# Altium schematic sheet DP_Slave_Sch.SchDoc
size A1
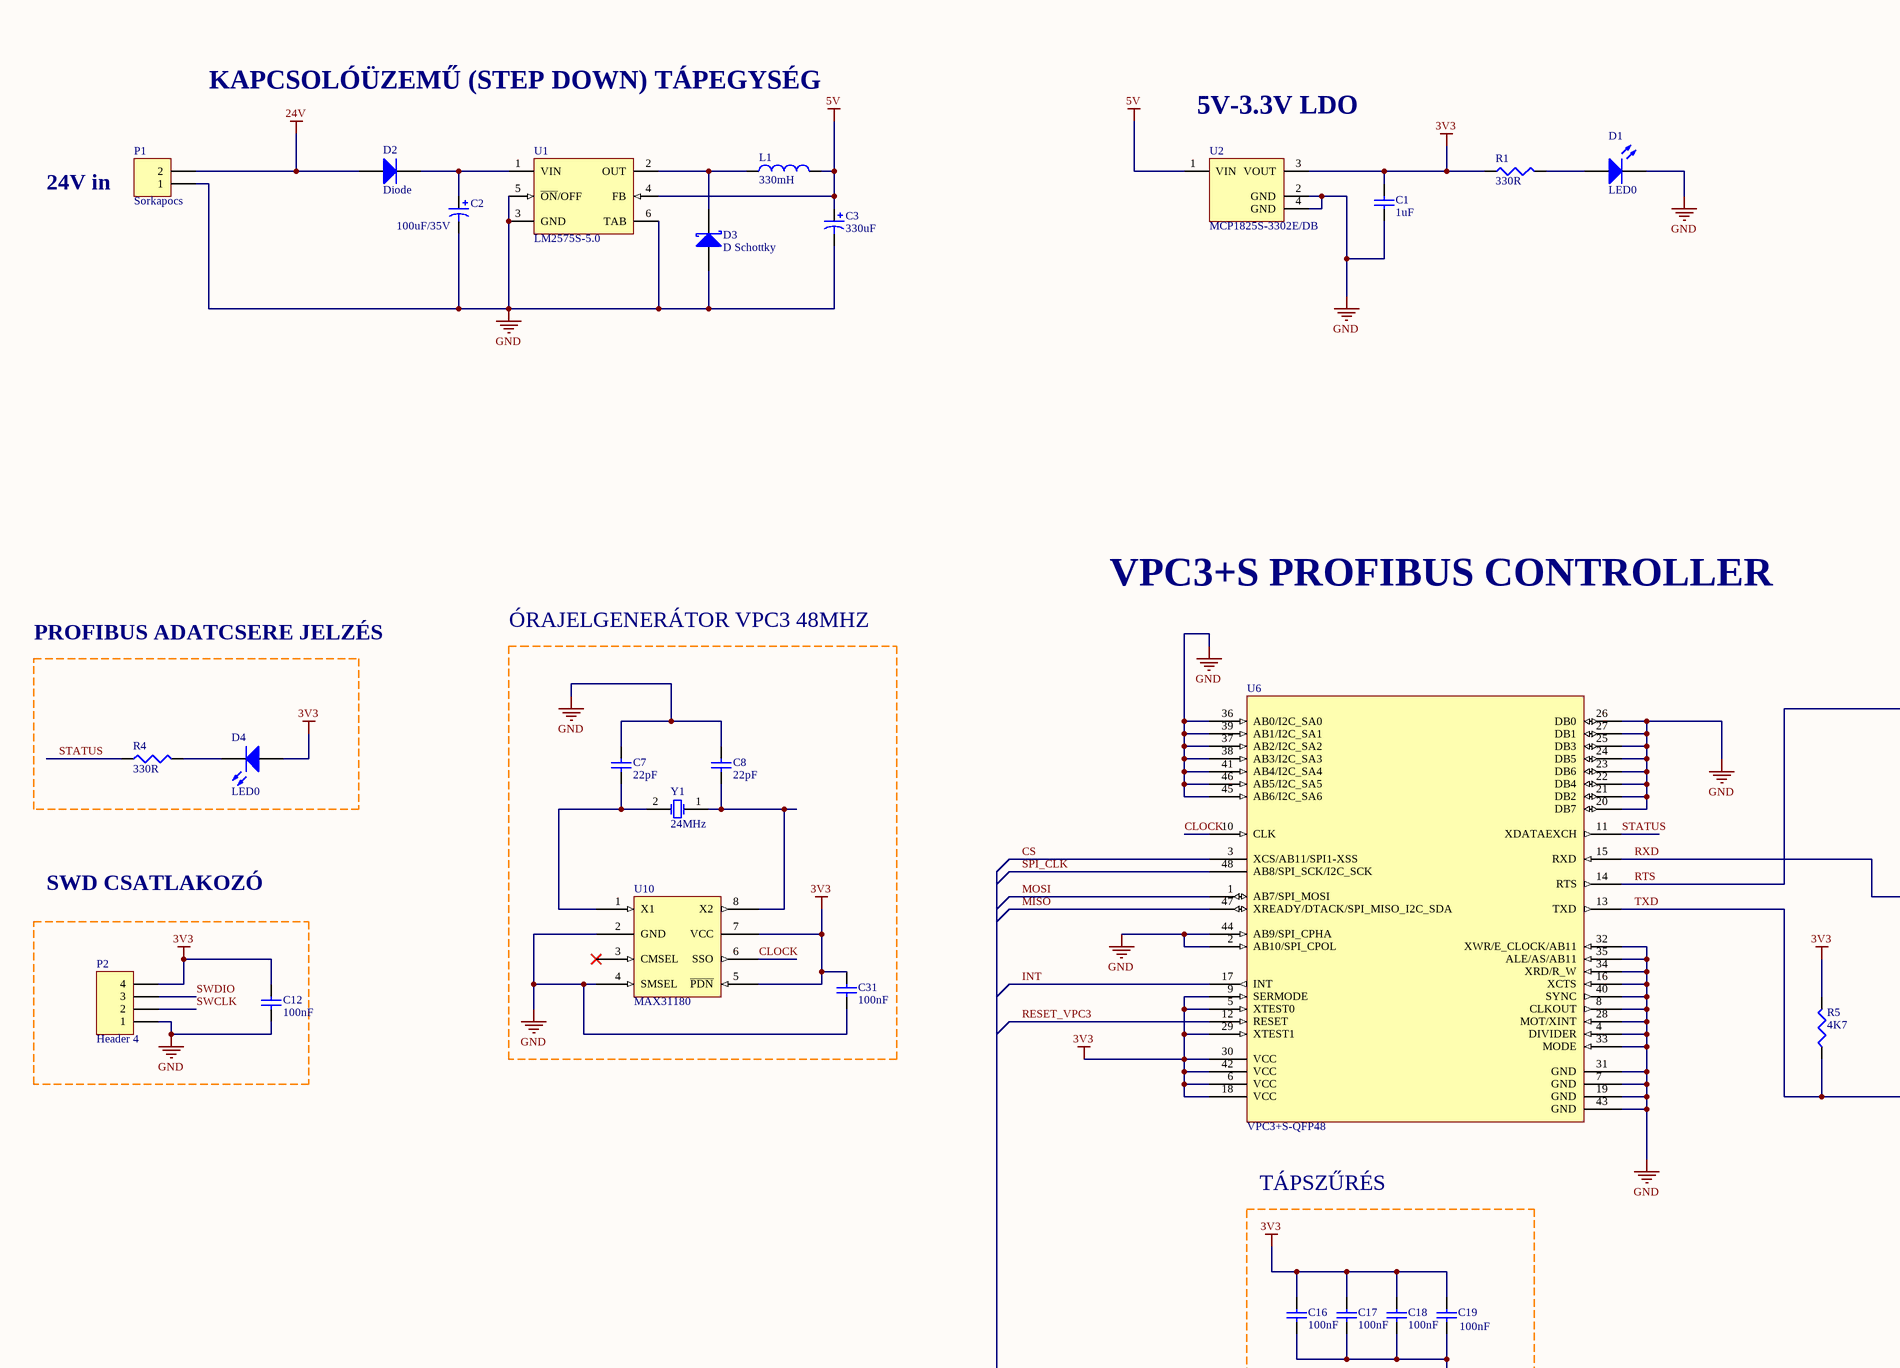
[diagram p0: DP_Slave_Sch.SchDoc, top left]
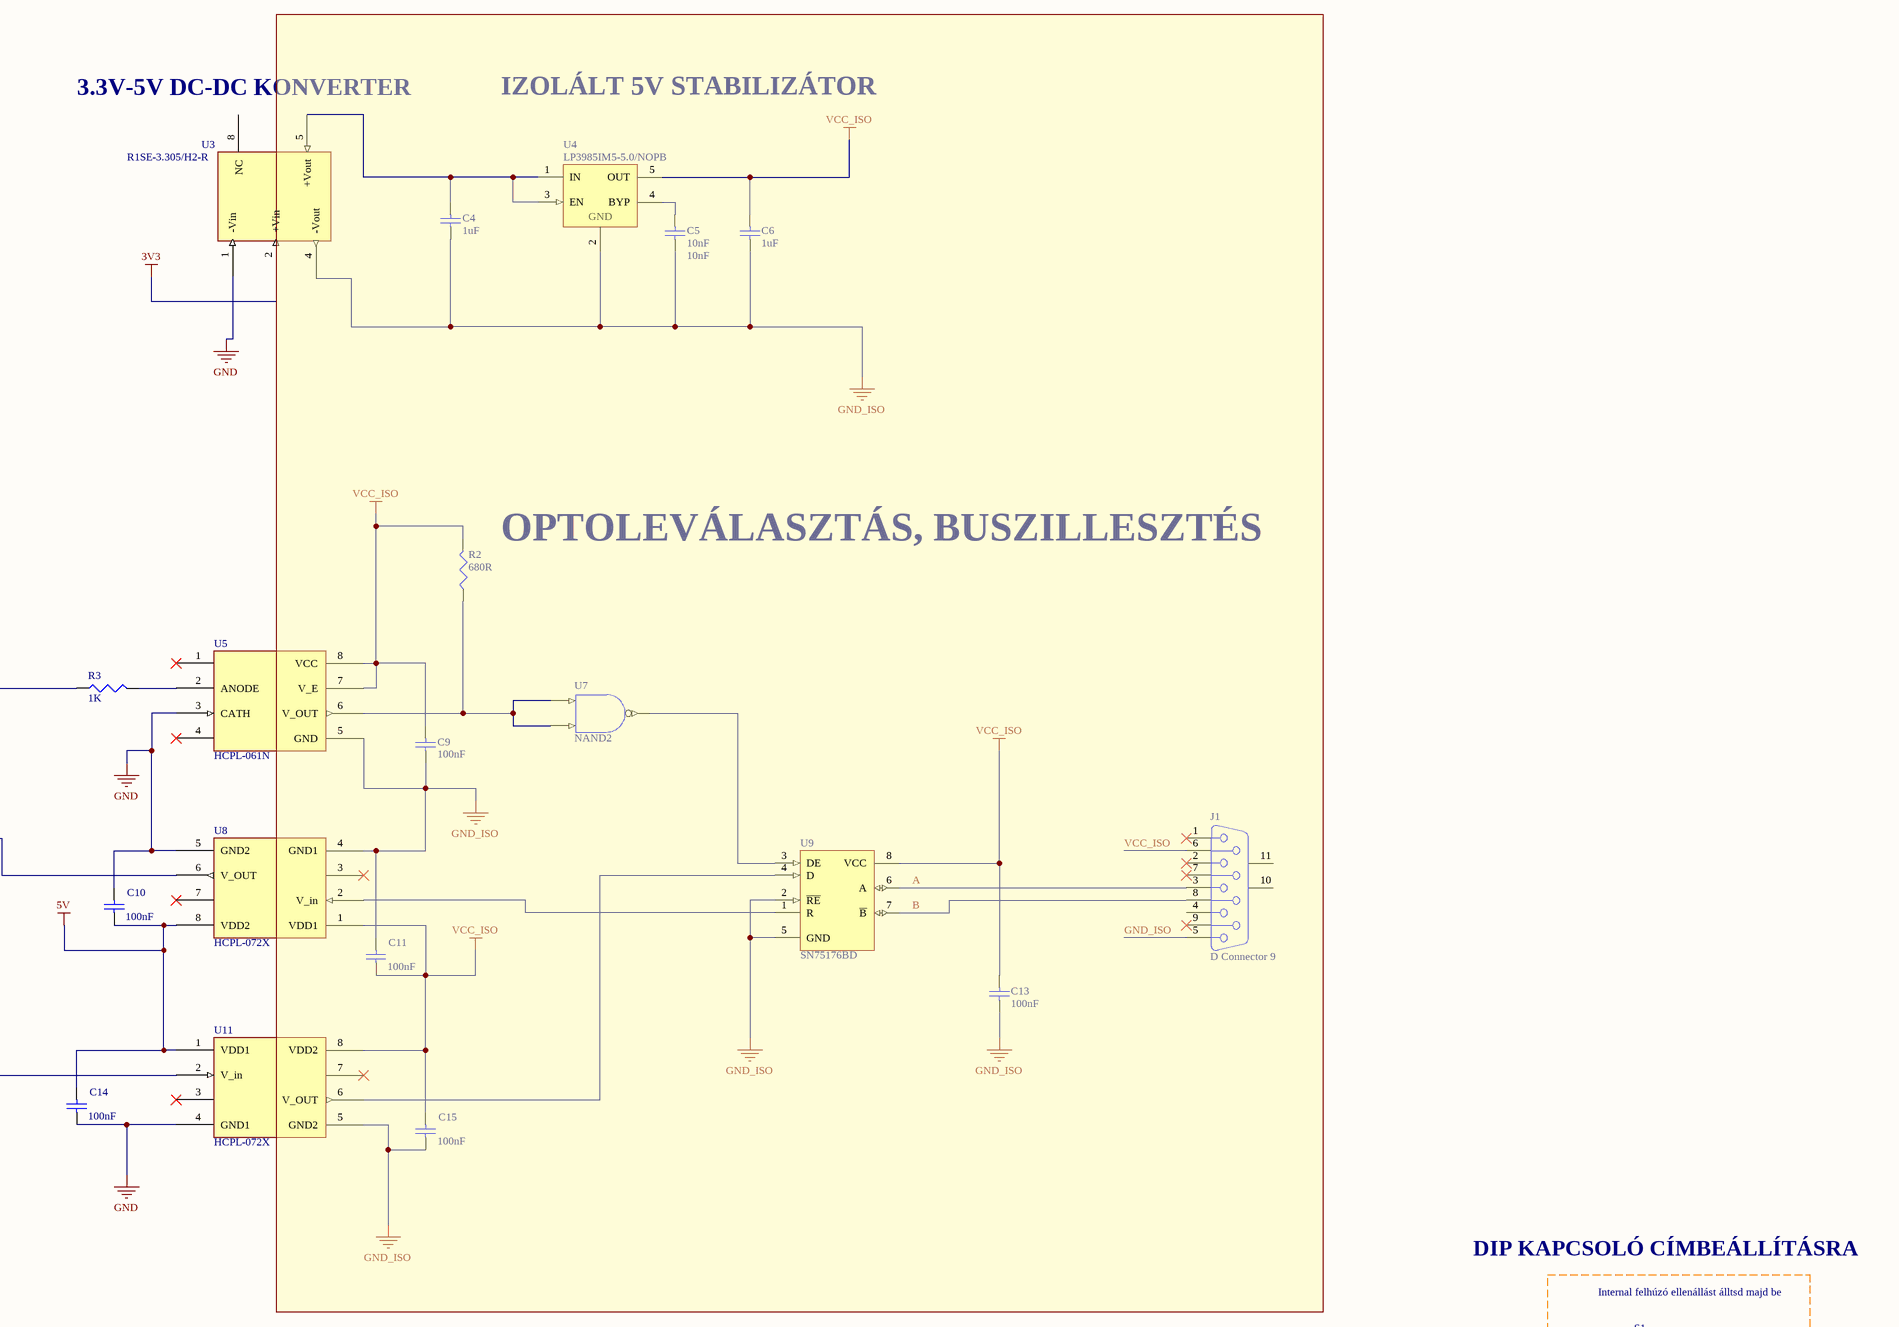
[diagram p1: DP_Slave_Sch.SchDoc, top right]
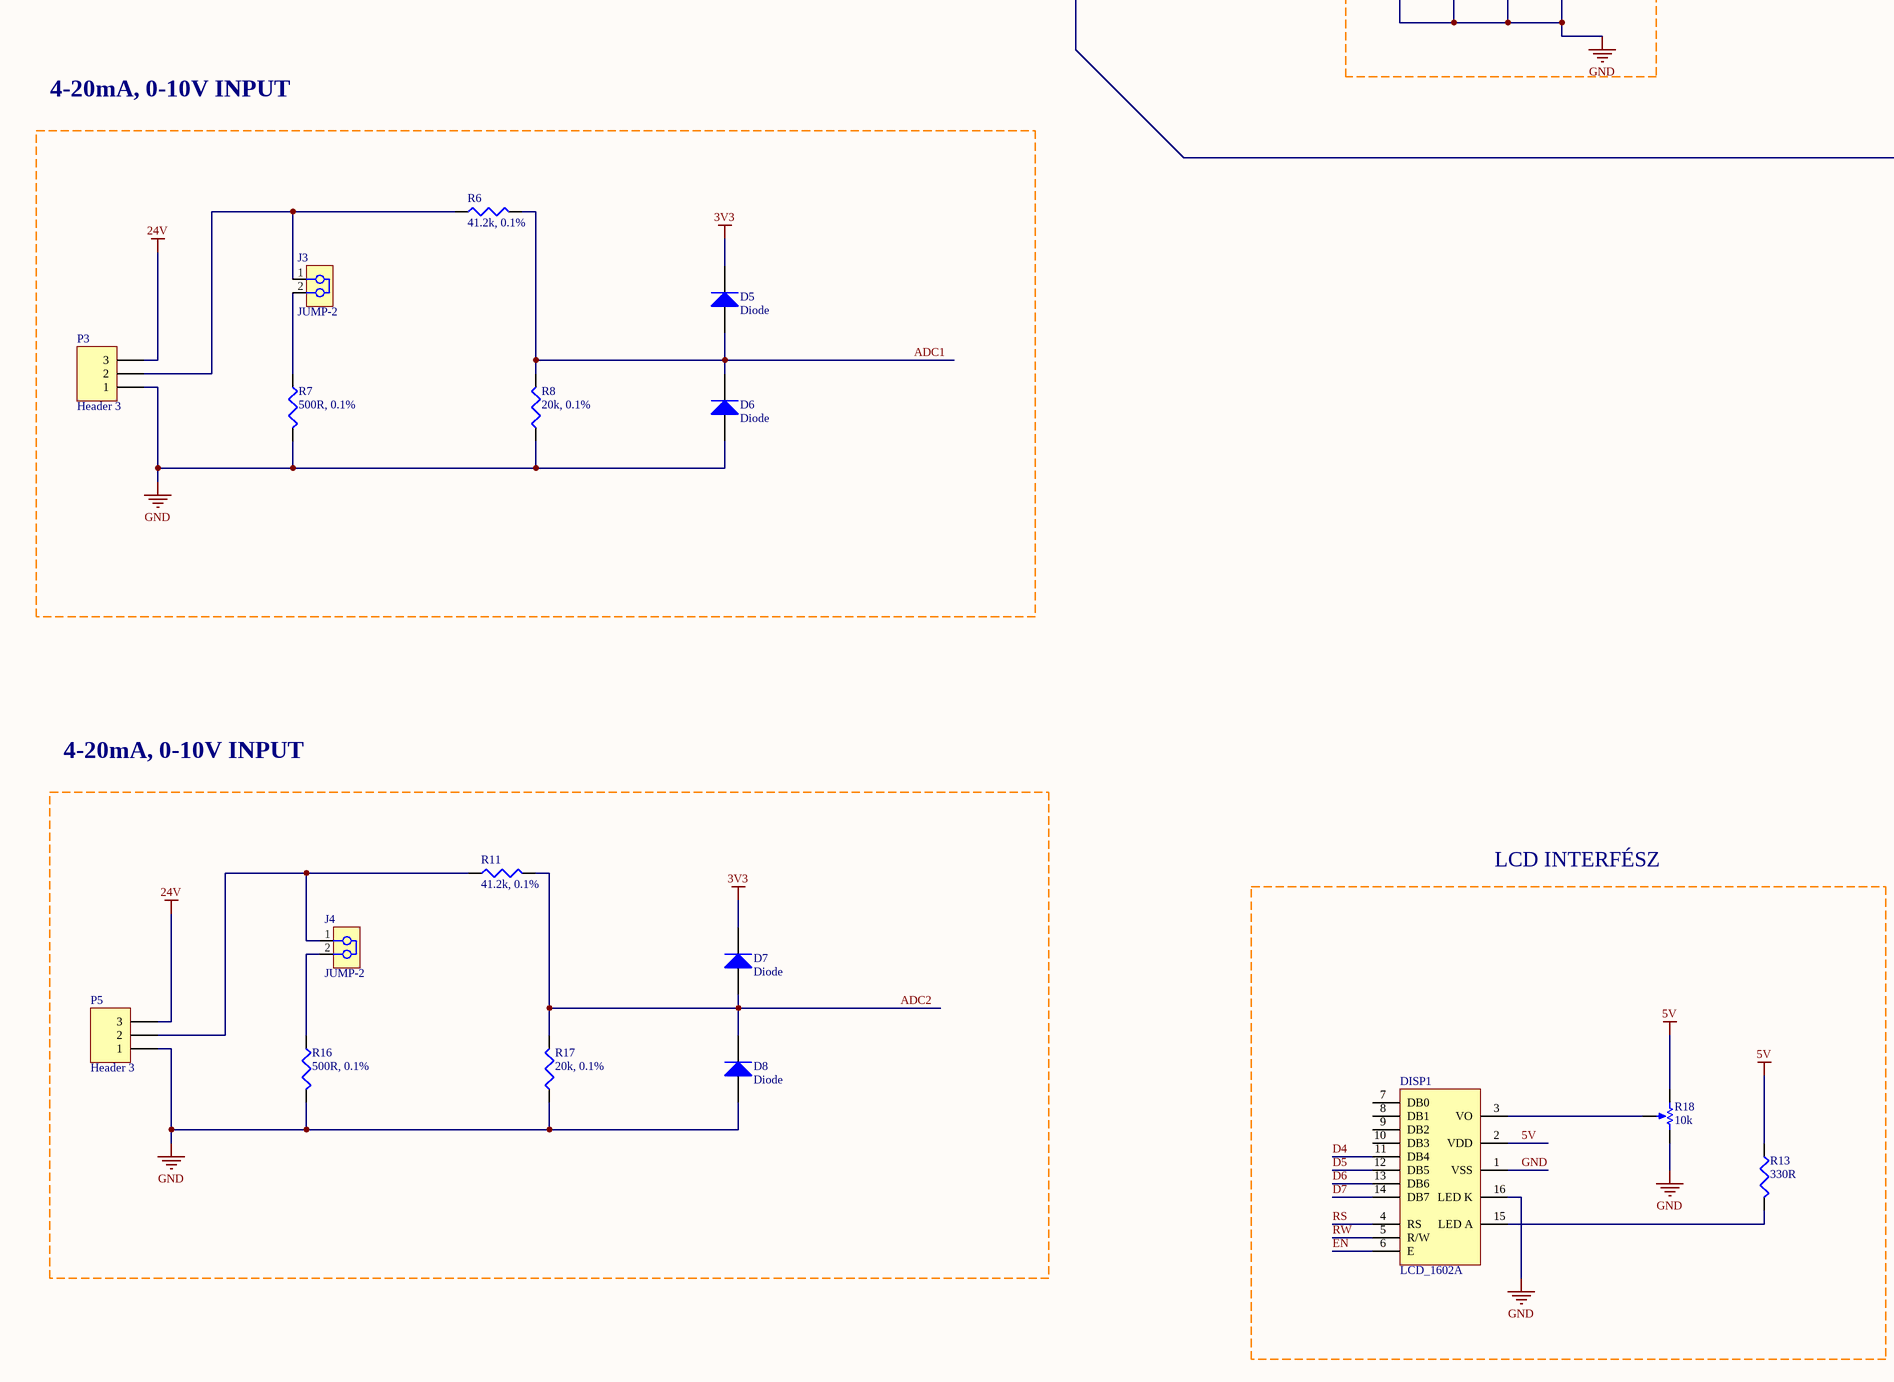
[diagram p2: DP_Slave_Sch.SchDoc, bottom left]
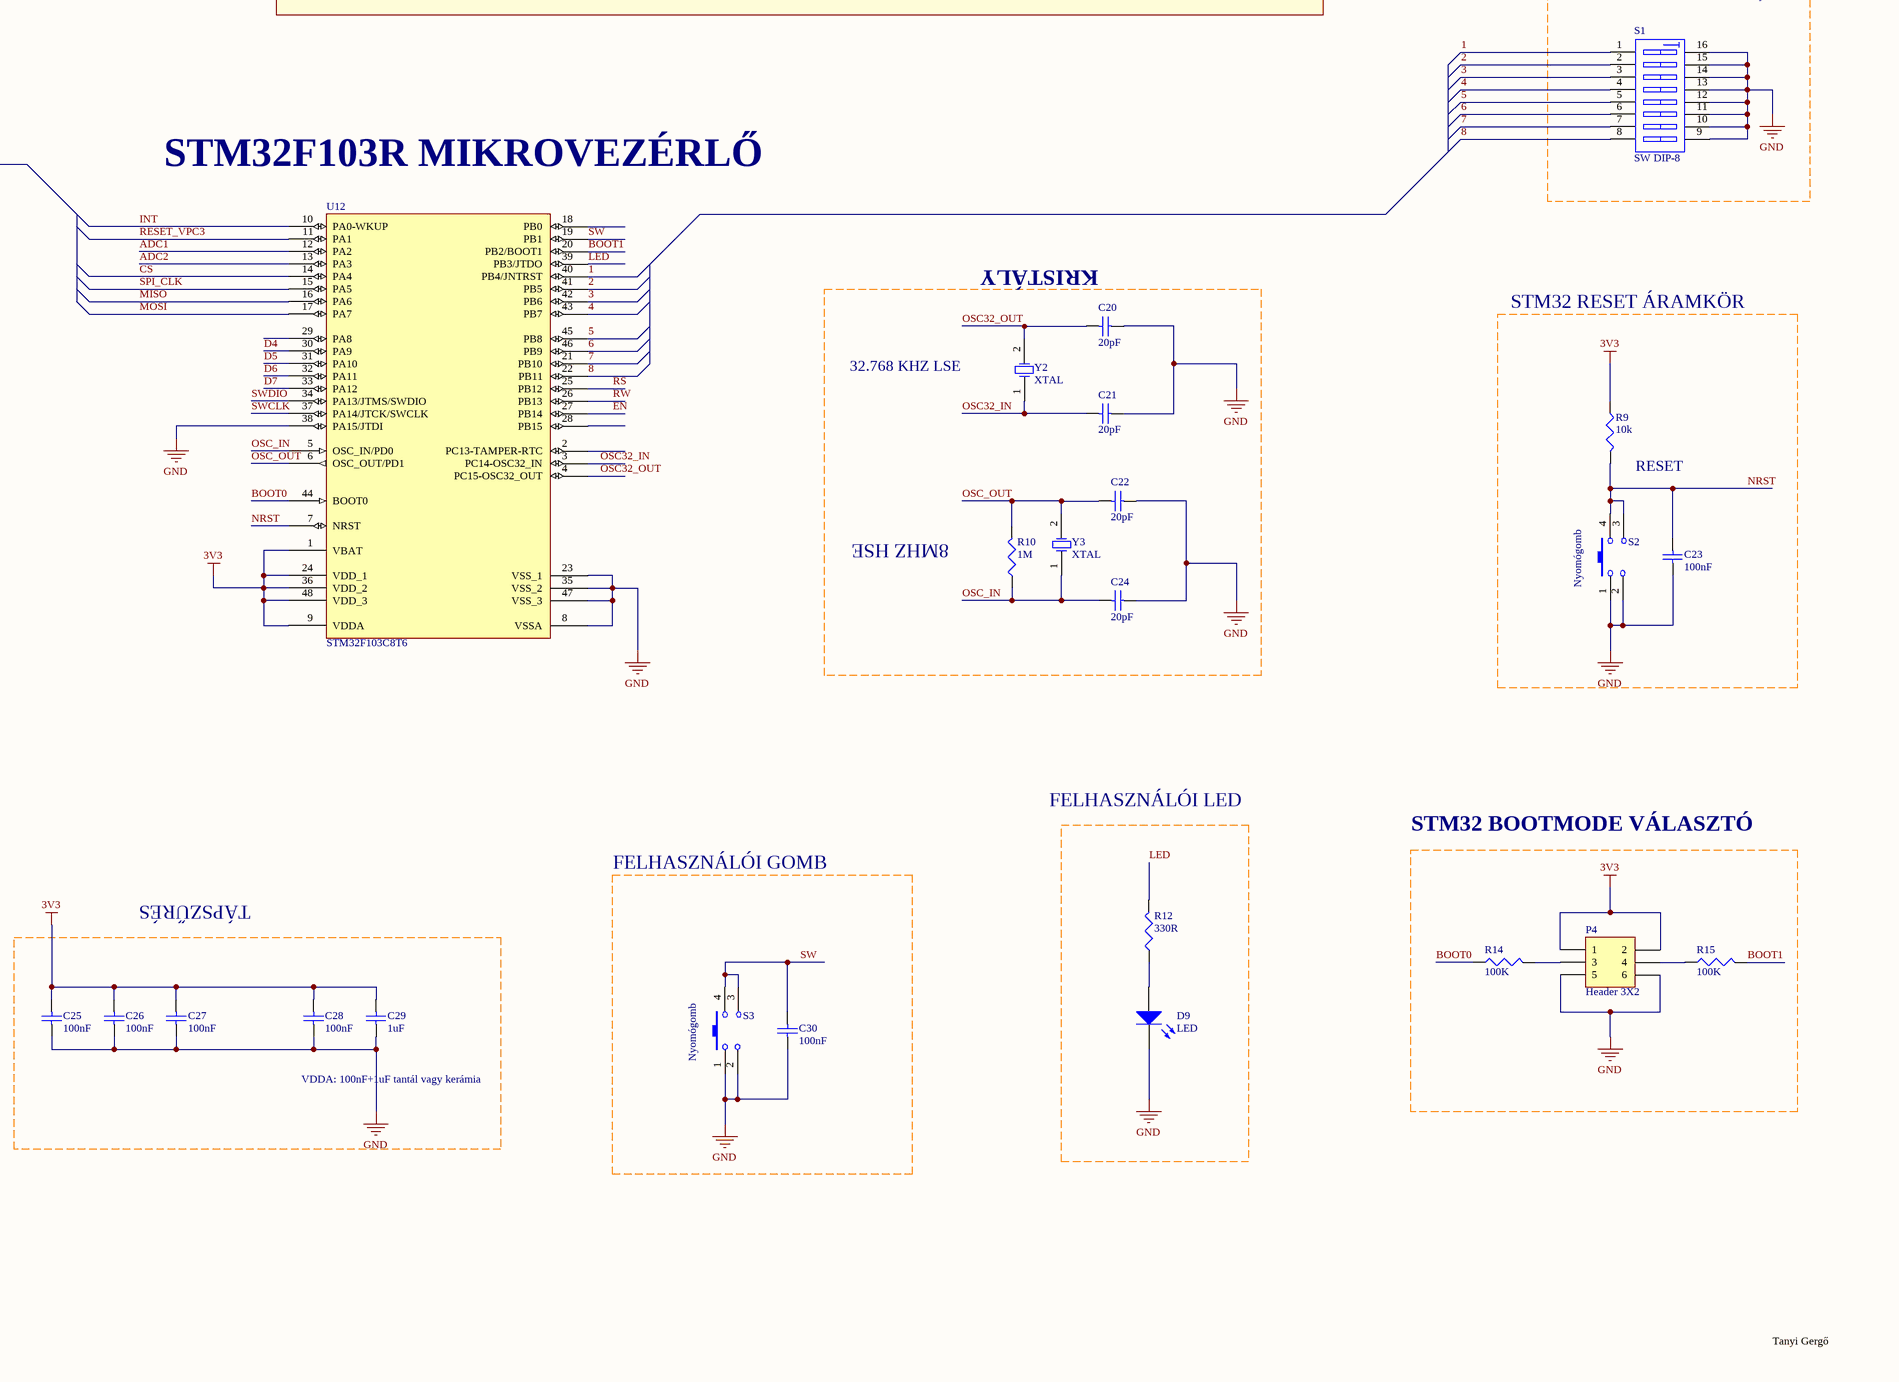
[diagram p3: DP_Slave_Sch.SchDoc, bottom right]

## Parts
C1  1uF  [C1206]
C2  100uF/35V  [SMD Elkó]
C3  330uF  [SMD Elkó]
C4  1uF  [C1206]
C5  10nF  [C1206]
C6  1uF  [C1206]
C7  22pF  [C1206]
C8  22pF  [C1206]
C9  100nF  [C1206]
C10  100nF  [C1206]
C11  100nF  [C1206]
C12  100nF  [C1206]
C13  100nF  [C1206]
C14  100nF  [C1206]
C15  100nF  [C1206]
C16  100nF  [C1206]
C17  100nF  [C1206]
C18  100nF  [C1206]
C19  100nF  [C1206]
C20  20pF  [C1206]
C21  20pF  [C1206]
C22  20pF  [C1206]
C23  100nF  [C1206]
C24  20pF  [C1206]
C25  100nF  [C1206]
C26  100nF  [C1206]
C27  100nF  [C1206]
C28  100nF  [C1206]
C29  1uF  [C1206]
C30  100nF  [C1206]
C31  100nF  [C1206]
D1  LED0  [C1206]
D2  Diode  [Dióda MiniMelf SOD80]
D3  D Schottky  [Schottky dióda]
D4  LED0  [C1206]
D5  Diode  [C1206]
D6  Diode  [C1206]
D7  Diode  [C1206]
D8  Diode  [C1206]
D9  LED  [c1206]
DISP1  LCD_1602A  [LCD]
J1  D Connector 9  [DSUB1.385-2H9]
J3  JUMP-2  [HDR1X2]
J4  JUMP-2  [HDR1X2]
L1  330mH  [SMD tekercs]
P1  Sorkapocs  [SORKAPOCS-2]
P2  Header 4  [HDR1X4]
P3  Header 3  [SORKAPOCS-3]
P4  Header 3X2  [HDR2X3]
P5  Header 3  [SORKAPOCS-3]
R1  330R  [C1206]
R2  680R  [C1206]
R3  1K  [C1206]
R4  330R  [C1206]
R5  4K7  [C1206]
R6  41.2k, 0.1%  [C1206]
R7  500R, 0.1%  [C1206]
R8  20k, 0.1%  [C1206]
R9  10k  [C1206]
R10  1M  [c1206]
R11  41.2k, 0.1%  [C1206]
R12  330R  [c1206]
R13  330R  [C1206]
R14  100K  [C1206]
R15  100K  [C1206]
R16  500R, 0.1%  [C1206]
R17  20k, 0.1%  [C1206]
R18  10k  [Potméter]
S1  SW DIP-8  [DIP switch]
S2  Nyomógomb  [Switch]
S3  Nyomógomb  [Switch]
U1  LM2575S-5.0  [TS5B_N]
U2  MCP1825S-3302E/DB  [SOT-223-DB3_N]
U3  R1SE-3.305/H2-R  [Isolated DC/DC converter]
U4  LP3985IM5-5.0/NOPB  [MF05A_N]
U5  HCPL-061N  [HCPL-061N]
U6  VPC3+S-QFP48  [TSQFP50P900X900X160-48N]
U7  NAND2  [NAND gate DIP14]
U8  HCPL-072X  [SOIC127P600X330-8N]
U9  SN75176BD  [D008_L]
U10  MAX31180  [MAX31180AUA+ -  Clock Generator]
U11  HCPL-072X  [SOIC127P600X330-8N]
U12  STM32F103C8T6  [LQFP48_N]
Y1  24MHz  [8 MHz SMD kristály]
Y2  XTAL  [32.768 MHz SMD kristály]
Y3  XTAL  [8 MHz SMD kristály]

## Blocks framed on the sheet
OPTOLEVÁLASZTÁS, BUSZILLESZTÉS: C4-C6 C9 C11 C13 C15 J1 R2 U4 U7 U9
PROFIBUS ADATCSERE JELZÉS: D4 R4
ÓRAJELGENERÁTOR VPC3 48MHZ: C7 C8 C31 U10 Y1
TÁPSZŰRÉS: C16-C19
Internal felhúzó ellenállást álltsd majd be: S1
8MHZ HSE: C20-C22 C24 R10 Y2 Y3
STM32 RESET ÁRAMKÖR: C23 R9 S2
LCD INTERFÉSZ: DISP1 R13 R18
STM32 BOOTMODE VÁLASZTÓ: P4 R14 R15
FELHASZNÁLÓI GOMB: C30 S3
VDDA: 100nF+1uF tantál vagy kerámia: C25-C29

## Nets
3V3: C1.2 C12.2 C16.2 C17.2 C18.2 C19.2 C25.2 C26.2 C27.2 C28.2 C29.2 C31.2 D4.1(A) D5.2(K) D7.2(K) P2.4 P4.1 P4.2 R1.1 R5.2 R9.1 U2.3(VOUT) U3.2(+Vin) U6.5(XTEST0) U6.6(VCC) U6.9(SERMODE) U6.18(VCC) U6.29(XTEST1) U6.30(VCC) U6.42(VCC) U10.5(~{PDN}) U10.7(VCC) U12.1(VBAT) U12.9(VDDA) U12.24(VDD_1) U12.36(VDD_2) U12.48(VDD_3)
5V: C3.1 C10.1 C14.2 DISP1.2(VDD) L1.2 R13.1 R18.1(TOP) U1.4(FB) U2.1(VIN) U8.8(VDD2) U11.1(VDD1)
24V: D2.1(A) P1.2 P3.3 P5.3
GND: C1.1 C2.2 C3.2 C7.2 C8.2 C10.2 C12.1 C14.1 C16.1 C17.1 C18.1 C19.1 C20.1 C21.1 C22.1 C23.1 C24.1 C25.1 C26.1 C27.1 C28.1 C29.1 C30.1 C31.1 D1.2(K) D3.1(A) D6.1(A) D8.1(A) D9.2(K) DISP1.1(VSS) DISP1.16(LED_K) P1.1 P2.1 P3.1 P4.5 P4.6 P5.1 R7.2 R8.1 R16.2 R17.1 R18.2(BOT) S1.9(B8) S1.10(B7) S1.11(B6) S1.12(B5) S1.13(B4) S1.14(B3) S1.15(B2) S1.16(B1) S2.1 S2.2 S3.1 S3.2 U1.3(GND) U1.5(~{ON}/OFF) U1.6(TAB) U2.2(GND) U2.4(GND) U3.1(-Vin) U5.3(CATH) U6.2(AB10/SPI_CPOL) U6.4(DIVIDER) U6.7(GND) U6.8(CLKOUT) U6.16(XCTS) U6.19(GND) U6.20(DB7) U6.21(DB2) U6.22(DB4) U6.23(DB6) U6.24(DB5) U6.25(DB3) U6.26(DB0) U6.27(DB1) U6.28(MOT/XINT) U6.31(GND) U6.32(XWR/E_CLOCK/AB11) U6.33(MODE) U6.34(XRD/R_W) U6.35(ALE/AS/AB11) U6.36(AB0/I2C_SA0) U6.37(AB2/I2C_SA2) U6.38(AB3/I2C_SA3) U6.39(AB1/I2C_SA1) U6.40(SYNC) U6.41(AB4/I2C_SA4) U6.43(GND) U6.44(AB9/SPI_CPHA) U6.45(AB6/I2C_SA6) U6.46(AB5/I2C_SA5) U8.5(GND2) U10.2(GND) U10.4(SMSEL) U11.4(GND1) U12.8(VSSA) U12.23(VSS_1) U12.35(VSS_2) U12.38(PA15/JTDI) U12.47(VSS_3)
GND_ISO: C4.1 C5.1 C6.1 C9.1 C11.2 C13.1 C15.1 J1.5 U3.4(-Vout) U4.2(GND) U5.5(GND) U8.4(GND1) U9.2(~{RE}) U9.5(GND) U11.5(GND2)
VCC_ISO: C6.2 C9.2 C11.1 C13.2 C15.2 J1.6 R2.2 U4.5(OUT) U5.7(V_E) U5.8(VCC) U8.1(VDD1) U9.8(VCC) U11.8(VDD2)
1: S1.1(A1) U12.40(PB4/JNTRST)
2: S1.2(A2) U12.41(PB5)
3: S1.3(A3) U12.42(PB6)
4: S1.4(A4) U12.43(PB7)
5: S1.5(A5) U12.45(PB8)
6: S1.6(A6) U12.46(PB9)
7: S1.7(A7) U12.21(PB10)
8: S1.8(A8) U12.22(PB11)
A: J1.3 U9.6(A)
ADC1: D5.1(A) D6.2(K) R6.2 R8.2 U12.12(PA2)
ADC2: D7.1(A) D8.2(K) R11.2 R17.2 U12.13(PA3)
B: J1.8 U9.7(~{B})
BOOT0: R14.1 U12.44(BOOT0)
BOOT1: R15.2 U12.20(PB2/BOOT1)
CLOCK: U6.10(CLK) U10.6(SSO)
CS: U6.3(XCS/AB11/SPI1-XSS) U12.14(PA4)
D4: DISP1.11(DB4) U12.30(PA9)
D5: DISP1.12(DB5) U12.31(PA10)
D6: DISP1.13(DB6) U12.32(PA11)
D7: DISP1.14(DB7) U12.33(PA12)
EN: DISP1.6(E) U12.27(PB14)
INT: U6.17(INT) U12.10(PA0-WKUP)
LED: R12.2 U12.39(PB3/JTDO)
MISO: U6.47(XREADY/DTACK/SPI_MISO_I2C_SDA) U12.16(PA6)
MOSI: U6.1(AB7/SPI_MOSI) U12.17(PA7)
NRST: C23.2 R9.2 S2.3 S2.4 U12.7(NRST)
OSC32_IN: C21.2 U12.3(PC14-OSC32_IN) Y2.1(OSC1)
OSC32_OUT: C20.2 U12.4(PC15-OSC32_OUT) Y2.2(OSC2)
OSC_IN: C24.2 R10.1 U12.5(OSC_IN/PD0) Y3.1(OSC1)
OSC_OUT: C22.2 R10.2 U12.6(OSC_OUT/PD1) Y3.2(OSC2)
RESET_VPC3: U6.12(RESET) U12.11(PA1)
RS: DISP1.4(RS) U12.25(PB12)
RTS: R3.1 U6.14(RTS)
RW: DISP1.5(R/W) U12.26(PB13)
RXD: U6.15(RXD) U8.6(V_OUT)
SPI_CLK: U6.48(AB8/SPI_SCK/I2C_SCK) U12.15(PA5)
STATUS: R4.1 U6.11(XDATAEXCH)
SW: C30.2 S3.3 S3.4 U12.19(PB1)
SWCLK: P2.2 U12.37(PA14/JTCK/SWCLK)
SWDIO: P2.3 U12.34(PA13/JTMS/SWDIO)
TXD: R5.1 U6.13(TXD) U11.2(V_in)
NetC2_1: C2.1 D2.2(K) U1.1(VIN)
NetC4_2: C4.2 U3.5(+Vout) U4.1(IN) U4.3(EN)
NetC5_2: C5.2 U4.4(BYP)
NetC7_1: C7.1 U10.1(X1) Y1.2(OSC2)
NetC8_1: C8.1 U10.8(X2) Y1.1(OSC1)
NetD1_1: D1.1(A) R1.2
NetD3_2: D3.2(K) L1.1 U1.2(OUT)
NetD4_2: D4.2(K) R4.2
NetD9_1: D9.1(A) R12.1
NetDISP1_3: DISP1.3(VO) R18.3(TAP)
NetDISP1_15: DISP1.15(LED_A) R13.2
NetJ3_1: J3.1(C1) P3.2 R6.1
NetJ3_2: J3.2(C2) R7.1
NetJ4_1: J4.1(C1) P5.2 R11.1
NetJ4_2: J4.2(C2) R16.1
NetP4_3: P4.3 R14.2
NetP4_4: P4.4 R15.1
NetR2_1: R2.1 U5.6(V_OUT) U7.1(A) U7.2(B)
NetR3_2: R3.2 U5.2(ANODE)
NetU7_3: U7.3(Y) U9.3(DE)
NetU8_2: U8.2(V_in) U9.1(R)
NetU9_4: U9.4(D) U11.6(V_OUT)

Not connected (* = marked no-connect by the designer): DISP1 7(DB0) 8(DB1) 9(DB2) 10(DB3); J1 1* 2* 4 7* 9* 10(MH1) 11(MH2); U3 8(NC); U5 1* 4*; U8 3* 7*; U10 3(CMSEL)*; U11 3* 7*; U12 2(PC13-TAMPER-RTC) 18(PB0) 28(PB15) 29(PA8)

## Notes on the sheet
- KAPCSOLÓÜZEMŰ (STEP DOWN) TÁPEGYSÉG
- 5V-3.3V LDO
- 3.3V-5V DC-DC KONVERTER
- IZOLÁLT 5V STABILIZÁTOR
- 24V in
- VPC3+S PROFIBUS CONTROLLER
- SWD CSATLAKOZÓ
- DIP KAPCSOLÓ CÍMBEÁLLÍTÁSRA
- 4-20mA, 0-10V INPUT
- STM32F103R MIKROVEZÉRLŐ
- (near C20) KRISTÁLY
- 32.768 KHZ LSE
- (near R9) RESET
- FELHASZNÁLÓI LED
- TÁPSZŰRÉS
- Tanyi Gergő

## Library data of the parts
C1 C12 C23 = Cap Semi: Szűrőkondi; Published: 8-Jun-2000; LatestRevisionDate: 29-May-2009; LatestRevisionNote: IPC-7351 Footprint Added.; PackageReference: C1206; Publisher: Altium Limited; PackageDescription: Chip Capacitor
  C1: Value: 1uF; ComponentLink1Description: Farnell; ComponentLink1URL: http://hu.farnell.com/multicomp/mcsh31b105k100ct/cap-mlcc-x7r-1uf-10v-1206/dp/1856632
  C12 C23: Value: 100nF
C2 = Cap Pol3: SMD elkó/40V; Value: 10uF; Published: 8-Jun-2000; LatestRevisionDate: 29-May-2009; LatestRevisionNote: IPC-7351 Footprint Added.; PackageReference: C0805; Publisher: Altium Limited; PackageDescription: Chip Capacitor; ComponentLink1Description: Farnell; ComponentLink1URL: http://hu.farnell.com/panasonic-electronic-components/eeehd1c100ar/cap-alu-elec-10uf-16v-smd/dp/1714728
C3 = Cap Pol3: LDO kimeneti polárkondi; Value: 10uF; Published: 8-Jun-2000; LatestRevisionDate: 29-May-2009; LatestRevisionNote: IPC-7351 Footprint Added.; PackageReference: C0805; Publisher: Altium Limited; PackageDescription: Chip Capacitor; ComponentLink1Description: Farnell; ComponentLink1URL: http://hu.farnell.com/panasonic-electronic-components/eeehd1c100ar/cap-alu-elec-10uf-16v-smd/dp/1714728
C4-C6 C16-C19 C31 = Cap Semi: Capacitor (Semiconductor SIM Model); Published: 8-Jun-2000; LatestRevisionDate: 29-May-2009; LatestRevisionNote: IPC-7351 Footprint Added.; PackageReference: C1206; Publisher: Altium Limited; PackageDescription: Chip Capacitor
  C4 C6: Value: 1uF
  C5: Value: 10nF
  C16-C19 C31: Value: 100nF
C7 C8 = Cap Semi: SMD kerámia; Value: 18pF; Published: 8-Jun-2000; LatestRevisionDate: 29-May-2009; LatestRevisionNote: IPC-7351 Footprint Added.; PackageReference: C1206; Publisher: Altium Limited; PackageDescription: Chip Capacitor
C9-C11 C13-C15 = Cap Semi: SMD KERÁMIA; Published: 8-Jun-2000; LatestRevisionDate: 29-May-2009; LatestRevisionNote: IPC-7351 Footprint Added.; PackageReference: C1206; Publisher: Altium Limited; PackageDescription: Chip Capacitor; Value: 100nF
C20-C22 C24 = Cap Semi: SMD kerámia; Value: 100pF; Published: 8-Jun-2000; LatestRevisionDate: 29-May-2009; LatestRevisionNote: IPC-7351 Footprint Added.; PackageReference: C1206; Publisher: Altium Limited; PackageDescription: Chip Capacitor
C25-C30 = Cap Semi: SMD kerámia; Published: 8-Jun-2000; LatestRevisionDate: 29-May-2009; LatestRevisionNote: IPC-7351 Footprint Added.; PackageReference: C1206; Publisher: Altium Limited; PackageDescription: Chip Capacitor
  C25-C28: Value: 100nF; ComponentLink1Description: Farnell; ComponentLink1URL: http://hu.farnell.com/avx/12063c104mat2a/ceramic-capacitor-0-1uf-25v-x7r/dp/4538754
  C29: Value: 1uF; ComponentLink1Description: Farnell; ComponentLink1URL: http://hu.farnell.com/avx/12063c104mat2a/ceramic-capacitor-0-1uf-25v-x7r/dp/4538754
  C30: Value: 100nF
D1 D4 = LED0: Typical INFRARED GaAs LED; Published: 8-Jun-2000; LatestRevisionDate: 08-Jul-2005; LatestRevisionNote: Mech Layer 1 removed.; PackageReference: LED-0; Publisher: Altium Limited; PackageDescription: LED; 2 Leads
D3 = D Schottky: Schottky Diode; Published: 8-Jun-2000; LatestRevisionDate: 17-Jul-2002; LatestRevisionNote: Re-released for DXP Platform.; PackageReference: SMB; Publisher: Altium Limited; PackageDescription: DO-214-AA/SMB; 2 C-Bend Leads; Body 5.3 x 3.6 mm, inc. leads (LxW); Code_JEDEC: DO-214-AA
D5-D8 = Diode: Default Diode; Published: 8-Jun-2000; LatestRevisionDate: 17-Jul-2002; LatestRevisionNote: Re-released for DXP Platform.; PackageVersion: Sep-1996; PackageReference: SMC; Publisher: Altium Limited; PackageDescription: DO-214-AB/SMC; 2 C-Bend Leads; Body 7.9 x 5.9 mm, inc. leads (LxW); Code_JEDEC: DO-214-AB
D9 = LED2: Piros felhasználói LED; Published: 8-Jun-2000; LatestRevisionDate: 17-Jul-2002; LatestRevisionNote: Re-released for DXP Platform.; PackageVersion: Feb-2002; PackageReference: 3.2X1.6X1.1; Publisher: Altium Limited; PackageDescription: SM LED; 2 Flat Leads
J1 = D Connector 9: Receptacle Assembly, 9 Position, Right Angle; PackageDocument: O; Positions: 9; Published: 15-Jun-2001; LatestRevisionDate: 17-Jul-2002; LatestRevisionNote: Re-released for DXP Platform.; DatasheetDocument: 1-Sep-1999; PackageReference: 788750; Publisher: Altium Limited; Orientation: Right Angle; Gender: Receptacle
L1 = Inductor: Code_IEC: 1005; Value: 10mH; Published: 8-Jun-2000; LatestRevisionDate: 29-May-2009; LatestRevisionNote: IPC-7351 Footprint Added.; PackageReference: 0402-A; Publisher: Altium Limited; PackageDescription: Chip Inductor; Code_JEITA: 0402
P1 = Header 2: 12V input; LatestRevisionDate: 17-Jul-2002; LatestRevisionNote: Re-released for DXP Platform.; Publisher: Altium Limited; ComponentLink1Description: Farnell; ComponentLink1URL: http://hu.farnell.com/switchcraft/rasm712x/jack-socket-dc/dp/1608734
P2 = Header 4: Header, 4-Pin; LatestRevisionDate: 17-Jul-2002; LatestRevisionNote: Re-released for DXP Platform.; Publisher: Altium Limited
P3 P5 = Header 3: Header, 3-Pin; LatestRevisionDate: 17-Jul-2002; LatestRevisionNote: Re-released for DXP Platform.; Publisher: Altium Limited
P4 = Header 3X2: Header, 3-Pin, Dual row; LatestRevisionDate: 17-Jul-2002; LatestRevisionNote: Re-released for DXP Platform.; Publisher: Altium Limited
R1 R4 R5 R10 R12 R14 R15 = Res3: SMD ellenállás; Value: 220; Published: 8-Jun-2000; LatestRevisionDate: 29-May-2009; LatestRevisionNote: IPC-7351 Footprint Added.; PackageReference: J1-0603; Publisher: Altium Limited; PackageDescription: Chip Resistor
R2 = Res3: Resistor; Published: 8-Jun-2000; LatestRevisionDate: 29-May-2009; LatestRevisionNote: IPC-7351 Footprint Added.; PackageReference: J1-0603; Publisher: Altium Limited; PackageDescription: Chip Resistor; Value: 680R
R3 = Res3: SMD ELLENÁLLÁS; Published: 8-Jun-2000; LatestRevisionDate: 29-May-2009; LatestRevisionNote: IPC-7351 Footprint Added.; PackageReference: J1-0603; Publisher: Altium Limited; PackageDescription: Chip Resistor; Value: 1K
R6-R9 R11 R13 R16 R17 = Res3: SMD ellenállás; Value: 330; Published: 8-Jun-2000; LatestRevisionDate: 29-May-2009; LatestRevisionNote: IPC-7351 Footprint Added.; PackageReference: J1-0603; Publisher: Altium Limited; PackageDescription: Chip Resistor
R18 = RPot: Potentiometer; Sim Note: Enter the Resistance value and the set point into parameter fields.; Set Position: 0.5; Value: 1K; Published: 8-Jun-2000; LatestRevisionDate: 17-Jul-2002; LatestRevisionNote: Re-released for DXP Platform.; PackageReference: VR5; Publisher: Altium Limited; PackageDescription: Variable Resistor, Thru-Hole; 3 Leads
S1 = SW DIP-8: DIP Switch, 8 Position, SPST; Published: 24-Mar-1999; LatestRevisionDate: 17-Jul-2002; LatestRevisionNote: Re-released for DXP Platform.; PackageReference: DIP_SW_8WAY_SMD; Publisher: Altium Limited; PackageDescription: DIP Switch; 16 Leads
S2 S3 = Tactile switch: 4 lábas, SMD, tactile; Mfr1: ALCOSWITCH - TE CONNECTIVITY; Mfr1 PN: FSM2JSMLS; ComponentLink1Description: Farnell; ComponentLink1URL: http://hu.farnell.com/te-connectivity-alcoswitch/fsm2jsmls/tactile-switch-spst-no-0-05a-24v/dp/2610948#anchorTechnicalDOCS; ComponentLink2Description: Datasheet; ComponentLink2URL: http://www.farnell.com/datasheets/2074943.pdf?_ga=2.199799912.731263013.1500916928-158472119.1495987916
U1 = LM2575S-5.0: SIMPLE SWITCHER® 1A Step-Down Voltage Regulator, 5-pin TO-263; Manufacturer: National Semiconductor; PackageTopMarking: NSUZXYTTE#*LM2575S*-5.0 P+; PowerWise: N; Published: 4-Dec-2008; DatasheetVersion: Apr-2007; PackageVersion: revD, Apr-2005; PackageReference: TS5B; Publisher: Altium Limited; PackageDescription: TO-263, Molded, .400 x .390 x .180in, 5 Lead, .067in Pitch, Surface Mount; Supplier 1: Farnell; Supplier Part Number 1: 1523849; Supplier 2: Farnell; Supplier Part Number 2: 9489860; PartNumber: LM2575S-5.0; RoHS: N; PinCount: 5; CompType: Switcher; Code_JEDEC: MO-169-AB; ComponentLink1Description: LM2575 Datasheet; ComponentLink1URL: http://www.national.com/ds/LM/LM2575.pdf; ComponentLink2Description: LM2575 Web Page; ComponentLink2URL: http://www.national.com/pf/LM/LM2575.html; ComponentLink3Description: TS5B Package Page; ComponentLink3URL: http://www.national.com/packaging/folders/ts5b.html
U2 = MCP1825S-3302E/DB: 500 mA, Low Voltage, Low Quiescent Current LDO Regulator, 3-Pin SOT-223, Extended Temperature; Manufacturer: Microchip; DatasheetVersion: revB, Feb-2008; PackageVersion: revBB, Aug-2009; PackageReference: SOT-223-DB3; PackageDescription: 3-Lead Plastic Small Outline Transistor (DB) [SOT-223]; Supplier 1: Digi-Key; Supplier Part Number 1: MCP1825S-3302E/DB-ND; Supplier 2: Farnell; Supplier Part Number 2: 1578404; Supplier 3: Newark; Supplier Part Number 3: 26M9961; Supplier 4: Mouser; Supplier Part Number 4: 579-MCP1825S-3302EDB; Mounting Technology: Surface Mount; PartNumber: MCP1825S-3302E/DB; ComponentLink1Description: Farnell; ComponentLink1URL: http://hu.farnell.com/microchip/mcp1825s-3302e-db/ic-ldo-3-3v-500ma-sot-223-3/dp/1578404?ost=MCP1825S-3302E%2FDB&scope=partnumberlookahead&exaMfpn=true&searchref=searchlookahead&searchView=table&iscrfnonsku=false&ddkey=http%3Ahu-HU%2FElement14_Hungary%2Fw%2Fsearch; ComponentLink2Description: Datasheet; ComponentLink2URL: http://ww1.microchip.com/downloads/en/DeviceDoc/22056b.pdf; ComponentLink3Description: Package Specification; ComponentLink3URL: http://www.microchip.com/stellent/groups/techpub_sg/documents/packagingspec/en012702.pdf
U3 = R1SE-3.305/H2-R: Isolated DC/DC converter 3.3-5V
U4 = LP3985IM5-5.0/NOPB: Micropower, 150mA Low-Noise Ultra Low-Dropout CMOS Voltage Regulator, 5-pin SOT-23, Pb-Free; Manufacturer: National Semiconductor; PackageTopMarking: LDSB*XTT; PowerWise: N; CompType: LDO IC; Published: 1-Mar-2010; DatasheetVersion: Aug-2005; PackageVersion: revD, Aug-2008; PackageReference: MF05A; Publisher: Altium Limited; PackageDescription: Molded SOT-23, .115 x .063 x .040 in Body, 5 Lead, .0375 in Pitch; Supplier 1: Digi-Key; Supplier Part Number 1: LP3985IM5-5.0TR-ND; Supplier 2: Digi-Key; Supplier Part Number 2: LP3985IM5-5.0CT-ND; Supplier 3: Digi-Key; Supplier Part Number 3: LP3985IM5-5.0DKR-ND; Supplier 4: Farnell; Supplier Part Number 4: 1694576; PartNumber: LP3985IM5-5.0/NOPB; RoHS: Y; PinCount: 5; ComponentLink1Description: LP3985 Datasheet; ComponentLink1URL: http://www.national.com/ds/LP/LP3985.pdf; ComponentLink2Description: LP3985 Web Page; ComponentLink2URL: http://www.national.com/pf/LP/LP3985.html; ComponentLink3Description: MF05A Package Page; ComponentLink3URL: http://www.national.com/packaging/folders/mf05a.html
U6 = VPC3+S(1): pROFIBUS CONTROLLER
U7 = NAND2: 2-Input NAND; FPGAVendor: Actel; Published: 25-Oct-2005; Publisher: Altium Limited; HelpURL: http://www.actel.com/documents/pa3_libguide_ug.pdf
U8 U11 = HCPL-072X: Optocoupler
U9 = SN75176BD: Differential Bus Transceiver; Note: Receiver Hysteresis of 50mV Typical; Published: 15-May-2002; LatestRevisionDate: 13-Apr-2006; LatestRevisionNote: IPC-7351 Footprint Added.; DatasheetVersion: Sep-1989; PackageVersion: Jan-1998; PackageReference: D008; Publisher: Altium Limited; PackageDescription: 8-Pin Small Outline Integrated Circuit 1.27 mm Pitch; Code_IPC: SOIC127P600-8; ComponentLink1Description: Manufacturer Link; ComponentLink1URL: http://www.ti.com/; ComponentLink2Description: Datasheet; ComponentLink2URL: http://www-s.ti.com/sc/ds/sn75176b.pdf
U12 = STM32F103C8T6: STM32 ARM-based 32-bit MCU with 64 Kbytes Flash, 48-pin LQFP, Industrial Temperature; Published: 30-May-2008; DatasheetVersion: rev6, Mar-2008; PackageVersion: Mar-2008; PackageReference: LQFP48; Publisher: Altium Limited; PackageDescription: 48-Pin Low-Profile Quad Flat Pack, 7 x 7 mm Body, 0.5 mm Pitch (LQFP48); ComponentLink1Description: Manufacturer Link; ComponentLink1URL: www.st.com/stm32; ComponentLink2Description: Datasheet; ComponentLink2URL: http://www.st.com/stonline/products/literature/ds/13587.pdf
Y1 = XTAL: SMD kristály; Published: 8-Jun-2000; LatestRevisionDate: 17-Jul-2002; LatestRevisionNote: Re-released for DXP Platform.; PackageReference: R38; Publisher: Altium Limited; PackageDescription: Crystal, Thru-Hole; 2 Leads; Body 3.1 x 8.2 mm (Dia.xH)
Y2 = XTAL: 32.768 KHz kristály; Published: 8-Jun-2000; LatestRevisionDate: 17-Jul-2002; LatestRevisionNote: Re-released for DXP Platform.; PackageReference: R38; Publisher: Altium Limited; PackageDescription: Crystal, Thru-Hole; 2 Leads; Body 3.1 x 8.2 mm (Dia.xH); ComponentLink1URL: http://hu.farnell.com/txc/9c-8-000maaj-t/xtal-8-000mhz-18pf-smd-hc-49s/dp/1842346; ComponentLink1Description: Farnell
Y3 = XTAL: 8 MHz kristály; Published: 8-Jun-2000; LatestRevisionDate: 17-Jul-2002; LatestRevisionNote: Re-released for DXP Platform.; PackageReference: R38; Publisher: Altium Limited; PackageDescription: Crystal, Thru-Hole; 2 Leads; Body 3.1 x 8.2 mm (Dia.xH); ComponentLink1Description: Farnell; ComponentLink1URL: http://hu.farnell.com/txc/9c-8-000maaj-t/xtal-8-000mhz-18pf-smd-hc-49s/dp/1842346
D2 = Diode: Published: 8-Jun-2000; LatestRevisionDate: 17-Jul-2002; LatestRevisionNote: Re-released for DXP Platform.; PackageVersion: Sep-1996; PackageReference: SMC; Publisher: Altium Limited; PackageDescription: DO-214-AB/SMC; 2 C-Bend Leads; Body 7.9 x 5.9 mm, inc. leads (LxW); Code_JEDEC: DO-214-AB; ComponentLink1URL: http://hu.farnell.com/taiwan-semiconductor/s1bl/diode-sgp-1a-100v/dp/1559149; ComponentLink1Description: Farnell